# Altium schematic sheet SSL-2020-MainBoard-Connectors.SchDoc
size A4
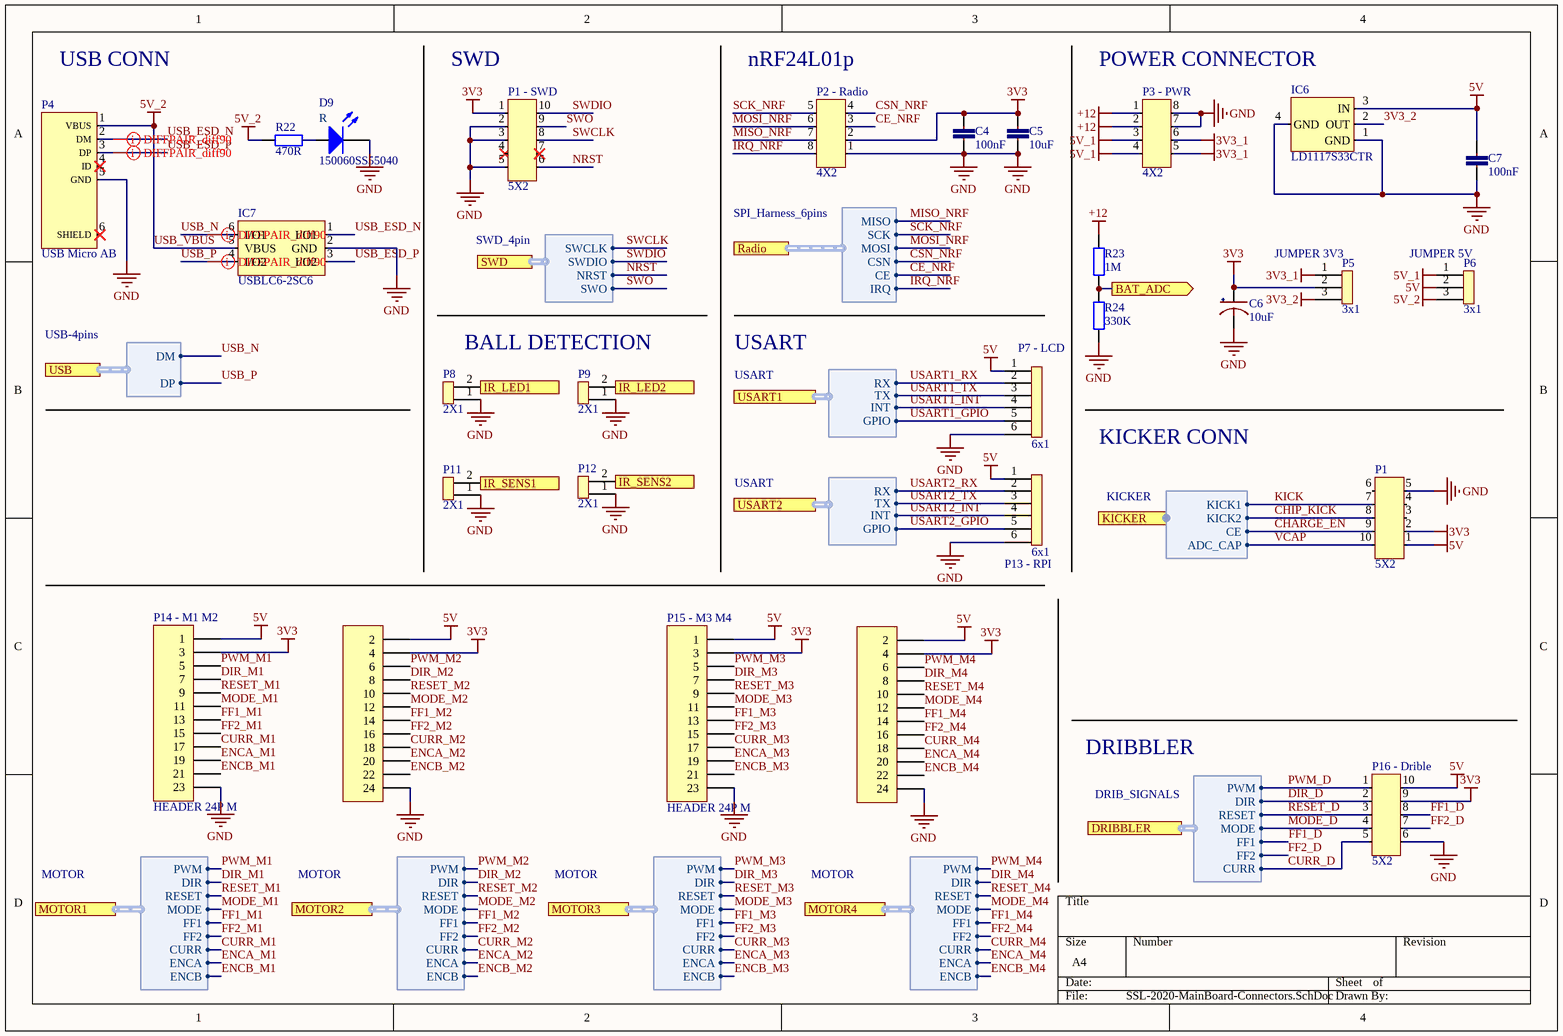
[diagram p0: SSL-2020-MainBoard-Connectors.SchDoc]

## Parts
C4  100nF  [CAP CER 0603]
C5  10uF  [CAP CER 0603]
C6  10uF  [CAP ALUM 5X5]
C7  100nF  [CAP CER 0603]
D9  150060SS55040  [LED 0603 RED]
IC6  LD1117S33CTR  [SOT-223]
IC7  USBLC6-2SC6  [SOT-23-6]
P1  5X2  [HEADER 5X2 MALE]
P1_-_SWD  5X2  [HEADER SWD]
P2_-_Radio  4X2  [NRF24L01P+HEADER]
P3_-_PWR  4X2  [HEADER 4X2 FEM]
P4  USB Micro AB  [USB-MICRO-AB]
P5  3x1  [HEADER 3X1 MALE]
P6  3x1  [HEADER 3X1 MALE]
P7_-_LCD  6x1  [HEADER 6X1 MALE]
P8  2X1  [HEADER 2X1 MALE]
P9  2X1  [HEADER 2X1 MALE]
P11  2X1  [HEADER 2X1 MALE]
P12  2X1  [HEADER 2X1 MALE]
P13_-_RPI  6x1  [HEADER 6X1 MALE]
P14_-_M1_M2  HEADER 24P M  [HEADER 12X2 MALE]
P15_-_M3_M4  HEADER 24P M  [HEADER 12X2 MALE]
P16_-_Drible  5X2  [HEADER 5X2 MALE]
R22  470R  [RES SMD 0603]
R23  1M  [RES SMD 0603]
R24  330K  [RES SMD 0603]

## Ports
BAT_ADC (out), DRIBBLER (harness DRIB_SIGNALS), IR_LED1 (in), IR_LED2 (in), IR_SENS1 (out), IR_SENS2 (out), KICKER (harness KICKER), MOTOR1 (harness MOTOR), MOTOR2 (harness MOTOR), MOTOR3 (harness MOTOR), MOTOR4 (harness MOTOR), Radio (harness SPI_Harness_6pins), SWD (harness SWD_4pin), USART1 (harness USART), USART2 (harness USART), USB (harness USB-4pins)

## Harnesses
USB-4pins: DM, DP
SWD_4pin: SWCLK, SWDIO, NRST, SWO
SPI_Harness_6pins: MISO, SCK, MOSI, CSN, CE, IRQ
MOTOR: PWM, DIR, RESET, MODE, FF1, FF2, CURR, ENCA, ENCB
USART: RX, TX, INT, GPIO
DRIB_SIGNALS: PWM, DIR, RESET, MODE, FF1, FF2, CURR
KICKER: KICK1, KICK2, CE, ADC_CAP

## Nets
3V3: C4.1 C5.1 C6.1 P1.2 P1_-_SWD.1 P2_-_Radio.2 P5.2 P14_-_M1_M2.3 P14_-_M1_M2.4 P15_-_M3_M4.3 P15_-_M3_M4.4 P16_-_Drible.9
3V3_1: P3_-_PWR.5 P3_-_PWR.6 P5.1
3V3_2: IC6.2(OUT) P5.3
5V: C7.1 IC6.3(IN) P1.1 P6.2 P7_-_LCD.1 P13_-_RPI.1 P14_-_M1_M2.1 P14_-_M1_M2.2 P15_-_M3_M4.1 P15_-_M3_M4.2 P16_-_Drible.10
5V_1: P3_-_PWR.3 P3_-_PWR.4 P6.1
+12: P3_-_PWR.1 P3_-_PWR.2 R23.2
GND: C4.2 C5.2 C6.2 C7.2 D9.2(N) IC6.1(GND) IC6.4(GND) IC7.2(GND) P1.5 P1_-_SWD.2 P1_-_SWD.3 P1_-_SWD.5 P2_-_Radio.1 P3_-_PWR.7 P3_-_PWR.8 P4.5(GND) P7_-_LCD.6 P8.1 P9.1 P11.1 P12.1 P13_-_RPI.6 P14_-_M1_M2.23 P14_-_M1_M2.24 P15_-_M3_M4.23 P15_-_M3_M4.24 P16_-_Drible.6 R24.1
USB_VBUS: IC7.5(VBUS) P4.1(VBUS) P6.3 R22.2  [also labelled 5V_2]
BAT_ADC: R23.1 R24.2 ; port BAT_ADC
CE_NRF: P2_-_Radio.3 ; port Radio.CE
CHARGE_EN: P1.9 ; port KICKER.CE
CHIP_KICK: P1.8 ; port KICKER.KICK2
CSN_NRF: P2_-_Radio.4 ; port Radio.CSN
CURR_D: P16_-_Drible.5 ; port DRIBBLER.CURR
CURR_M1: P14_-_M1_M2.17 ; port MOTOR1.CURR
CURR_M2: P14_-_M1_M2.18 ; port MOTOR2.CURR
CURR_M3: P15_-_M3_M4.17 ; port MOTOR3.CURR
CURR_M4: P15_-_M3_M4.18 ; port MOTOR4.CURR
DIR_D: P16_-_Drible.2 ; port DRIBBLER.DIR
DIR_M1: P14_-_M1_M2.7 ; port MOTOR1.DIR
DIR_M2: P14_-_M1_M2.8 ; port MOTOR2.DIR
DIR_M3: P15_-_M3_M4.7 ; port MOTOR3.DIR
DIR_M4: P15_-_M3_M4.8 ; port MOTOR4.DIR
ENCA_M1: P14_-_M1_M2.19 ; port MOTOR1.ENCA
ENCA_M2: P14_-_M1_M2.20 ; port MOTOR2.ENCA
ENCA_M3: P15_-_M3_M4.19 ; port MOTOR3.ENCA
ENCA_M4: P15_-_M3_M4.20 ; port MOTOR4.ENCA
ENCB_M1: P14_-_M1_M2.21 ; port MOTOR1.ENCB
ENCB_M2: P14_-_M1_M2.22 ; port MOTOR2.ENCB
ENCB_M3: P15_-_M3_M4.21 ; port MOTOR3.ENCB
ENCB_M4: P15_-_M3_M4.22 ; port MOTOR4.ENCB
FF1_D: P16_-_Drible.8 ; port DRIBBLER.FF1
FF1_M1: P14_-_M1_M2.13 ; port MOTOR1.FF1
FF1_M2: P14_-_M1_M2.14 ; port MOTOR2.FF1
FF1_M3: P15_-_M3_M4.13 ; port MOTOR3.FF1
FF1_M4: P15_-_M3_M4.14 ; port MOTOR4.FF1
FF2_D: P16_-_Drible.7 ; port DRIBBLER.FF2
FF2_M1: P14_-_M1_M2.15 ; port MOTOR1.FF2
FF2_M2: P14_-_M1_M2.16 ; port MOTOR2.FF2
FF2_M3: P15_-_M3_M4.15 ; port MOTOR3.FF2
FF2_M4: P15_-_M3_M4.16 ; port MOTOR4.FF2
IR_LED1: P8.2 ; port IR_LED1
IR_LED2: P9.2 ; port IR_LED2
IR_SENS1: P11.2 ; port IR_SENS1
IR_SENS2: P12.2 ; port IR_SENS2
IRQ_NRF: P2_-_Radio.8 ; port Radio.IRQ
KICK: P1.7 ; port KICKER.KICK1
MISO_NRF: P2_-_Radio.7 ; port Radio.MISO
MODE_D: P16_-_Drible.4 ; port DRIBBLER.MODE
MODE_M1: P14_-_M1_M2.11 ; port MOTOR1.MODE
MODE_M2: P14_-_M1_M2.12 ; port MOTOR2.MODE
MODE_M3: P15_-_M3_M4.11 ; port MOTOR3.MODE
MODE_M4: P15_-_M3_M4.12 ; port MOTOR4.MODE
MOSI_NRF: P2_-_Radio.6 ; port Radio.MOSI
NRST: P1_-_SWD.6 ; port SWD.NRST
PWM_D: P16_-_Drible.1 ; port DRIBBLER.PWM
PWM_M1: P14_-_M1_M2.5 ; port MOTOR1.PWM
PWM_M2: P14_-_M1_M2.6 ; port MOTOR2.PWM
PWM_M3: P15_-_M3_M4.5 ; port MOTOR3.PWM
PWM_M4: P15_-_M3_M4.6 ; port MOTOR4.PWM
RESET_D: P16_-_Drible.3 ; port DRIBBLER.RESET
RESET_M1: P14_-_M1_M2.9 ; port MOTOR1.RESET
RESET_M2: P14_-_M1_M2.10 ; port MOTOR2.RESET
RESET_M3: P15_-_M3_M4.9 ; port MOTOR3.RESET
RESET_M4: P15_-_M3_M4.10 ; port MOTOR4.RESET
SCK_NRF: P2_-_Radio.5 ; port Radio.SCK
SWCLK: P1_-_SWD.8 ; port SWD.SWCLK
SWDIO: P1_-_SWD.10 ; port SWD.SWDIO
SWO: P1_-_SWD.9 ; port SWD.SWO
USART1_GPIO: P7_-_LCD.5 ; port USART1.GPIO
USART1_INT: P7_-_LCD.4 ; port USART1.INT
USART1_RX: P7_-_LCD.2 ; port USART1.RX
USART1_TX: P7_-_LCD.3 ; port USART1.TX
USART2_GPIO: P13_-_RPI.5 ; port USART2.GPIO
USART2_INT: P13_-_RPI.4 ; port USART2.INT
USART2_RX: P13_-_RPI.2 ; port USART2.RX
USART2_TX: P13_-_RPI.3 ; port USART2.TX
USB_ESD_N: IC7.1(I/O1) P4.2(DM)
USB_ESD_P: IC7.3(I/O2) P4.3(DP)
USB_N: IC7.6(I/O1) ; port USB.DM
USB_P: IC7.4(I/O2) ; port USB.DP
VCAP: P1.10 ; port KICKER.ADC_CAP
NetD9_1: D9.1(P) R22.1

Not connected (* = marked no-connect by the designer): P1 3 4 6; P1_-_SWD 4* 7*; P4 4(ID)* 6(SHIELD)*

## Layout directives
differential pair; differential pair class diff90: USB_ESD_N, USB_ESD_P, USB_N, USB_P

## Notes on the sheet
- (near P4) USB CONN
- (near P1_-_SWD) SWD
- (near P2_-_Radio) nRF24L01p
- POWER CONNECTOR
- (near P5) JUMPER 3V3
- (near P6) JUMPER 5V
- BALL DETECTION
- USART
- KICKER CONN
- DRIBBLER
- (in symbol 150060SS55040) R

## Library data of the parts
C4 C7 = CAP CER 0603 25V 100nF: Multilayer Ceramic Capacitors MLCC - SMD/SMT 25V 0.1uF 0603 Y5V -20/+80%; Mfr Nr: C0603C104Z3VACTU; Mfr: KEMET; Type: Ceramic Capacitor; Dimensions: 0603 (1608 metric); Voltage Rating: 25V; Series: SMD Comm Y5V; Value: 100nF
C5 = CAP CER 0603 6.3V 10uF: Multilayer Ceramic Capacitors MLCC - SMD/SMT 0603 6.3V 10uF X5R 10% Soft Term; Mfr Nr: C1608X5R0J106K080AE; Mfr: TDK; Type: Ceramic Capacitor; Dimensions: 0603 (1608 metric); Voltage Rating: 6.3V; Series: C; Value: 10uF
C6 = CAP ALUM 25V 10uF: Aluminum Electrolytic Capacitors - SMD 25volts 10uF 5x5.4 20%; Mfr: Nichion; Mfr Nr: UWX1E100MCL1GB; Voltage Rating: 25V; Type: Surface Mount Aluminum Electrolytic Capacitor; Dimensions: 5x5mm; Series: UWX; Value: 10uF
D9 = 150060SS55040: Standard LEDs - SMD WL-SMCD SMD MonoChip 0603 Super Red 645nm; Mfr: Wurth Elektronik; Forward Current: 20mA; Forward Voltage: 2V; Package: 0603 (1608 metric); Series: WL-SMCD; Color: Red
IC6 = LD1117S33CTR: LOW DROPOUT REGULATORS(LDO) POSITIVE FIXED 1.3V @ 800MA 15V 3.3V 800MA SOT-223 ROHS; Mfr: STMicroelectronics; Series: LD1117; Package: SOT-223-3; Mfr Nr: LD1117S33CTR
IC7 = USBLC6-2SC6: DIODES - ESD SOT-23-6 ROHS; Mfr: STMicroelectronics; Series: USBLC6-2; Package: SOT-23-6; Mfr Nr: USBLC6-2SC6
P1 P16_-_Drible = HEADER 10P M
P1_-_SWD = HEADER 10P M: Headers & Wire Housings ArcherM50 1.27mmPitc DIL Vert Pin Head; Mfr: Harwin; Mfr Nr: M50-3600542R; Pitch: 1.27mm
P2_-_Radio P3_-_PWR = HEADER 8P F: Headers & Wire Housings 04+04 DIL VERTICAL SOCKET TIN; Mfr: Harwin; Mfr Nr: M20-7830446; Pitch: 2.54mm; Series: M20; Type: Socket Assembly; Contact Gender: Socket (Female)
P4 = USB Micro AB: USB Connectors WR-COM USB Micro SMT Type AB Horiztl; Mfr: Wurth Elektronik; Mfr Nr: 629105150921; Current Rating: 1.8 A; Gender: Jack (Female); Type: Micro USB AB; Series: WR-COM
P5 P6 = HEADER 3P M: Headers & Wire Housings 03 SIL VERTICAL PIN HEADER TIN; Mfr Nr: M20-9770346
P7_-_LCD P13_-_RPI = HEADER 6P M: Connector Header Through Hole 6 position 0.100" (2.54mm)
P8 P9 P11 P12 = HEADER 2P M
R22 = RES SMD 0603 470R: Thick Film Resistors 1/10Watt 470ohms 1% Commercial Use; Mfr: Vishay / Dale; Mfr Nr: CRCW0603470RFKEAC; Power Rating: 1/10 W; Dimensions: 0603 (1608 metric); Value: 470R
R23 = RES SMD 0603 1M: Thick Film Resistors - SMD 1/10Watt 1Mohms 1% Commercial Use; Mfr: Vishay / Dale; Mfr Nr: CRCW06031M00FKEAC; Power Rating: 1/10 W; Dimensions: 0603 (1608 metric); Value: 1M
R24 = RES SMD 0603 330K: Thick Film Resistors 1/10Watt 330Kohms 1% Commercial Use; Mfr: Vishay / Dale; Mfr Nr: CRCW0603330KFKEAC; Power Rating: 1/10 W; Dimensions: 0603 (1608 metric); Value: 330K